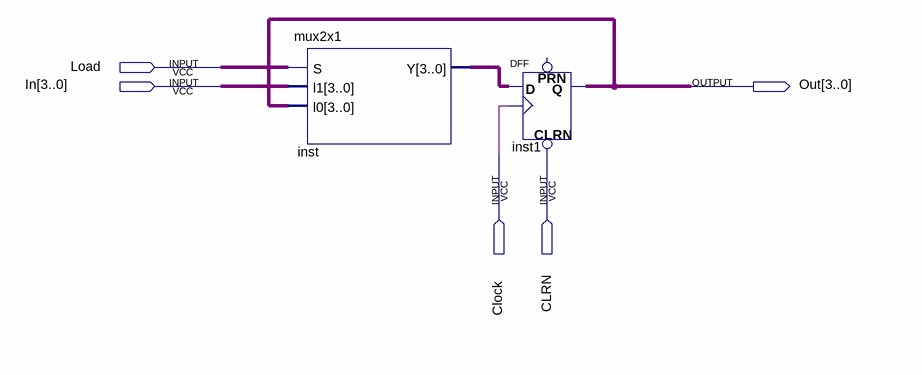
[diagram p0: schematic sheet]
// Quartus schematic register.bdf as structural Verilog: 2 symbols, 5 pins
module register (
  input  Load,
  input  [3:0] In,
  input  Clock,
  input  CLRN,
  output [3:0] Out
);

  wire [3:0] inst_y;

  mux2x1 inst (.S(Load), .l1(In), .l0(Out), .Y(inst_y));
  DFF inst1[3:0] (.CLRN(CLRN), .CLK(Clock), .D(inst_y), .Q(Out));  // open: PRN
endmodule
